# EAGLE schematic SCHEMA0529 (EAGLE 9.6.2)
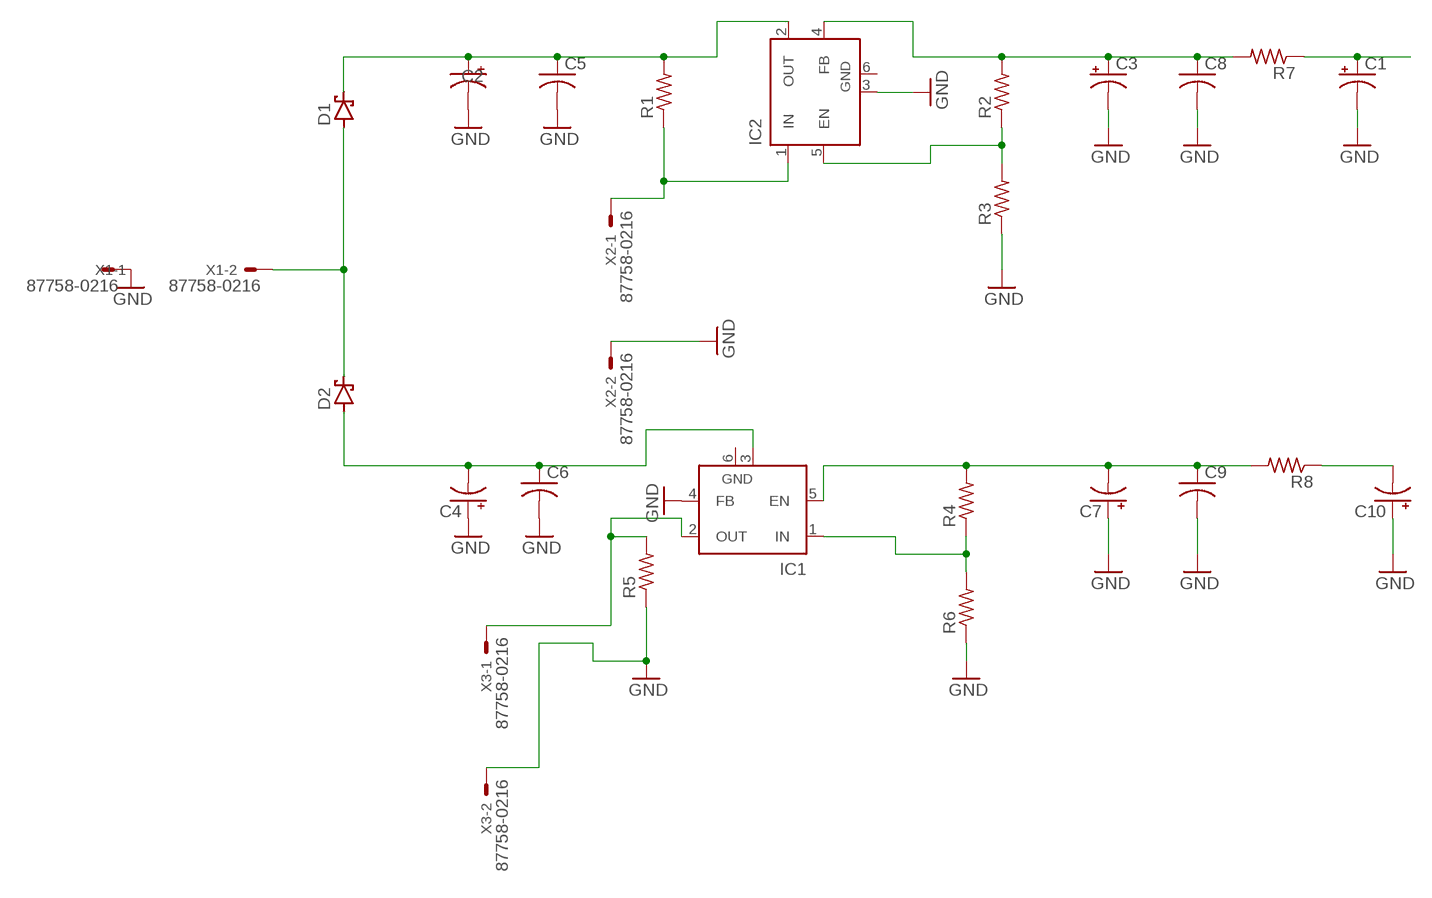
[diagram p0: schematic, sheet 1]

## Parts
C1  CPOL-USTT5D10  [TT5D10]
C2  CPOL-USE7.5-18  [E7,5-18]
C3  CPOL-USD/7343-31R  [D/7343-31R]
C4  CPOL-USE7.5-18  [E7,5-18]
C5  C-USC0805  [C0805]
C6  C-USC0805  [C0805]
C7  CPOL-USD/7343-31R  [D/7343-31R]
C8  C-USC0805  [C0805]
C9  C-USC0805  [C0805]
C10  CPOL-USTT5D10  [TT5D10]
D1  SCHOTTKY-DIODESMD  [SMB]
D2  SCHOTTKY-DIODESMD  [SMB]
IC1  LM2596S  [TO263-5]
IC2  LM2596S  [TO263-5]
R1  R-US_R0805  [R0805]
R2  R-US_R0805  [R0805]
R3  R-US_R0805  [R0805]
R4  R-US_R0805  [R0805]
R5  R-US_R0805  [R0805]
R6  R-US_R0805  [R0805]
R7  R-US_R0805  [R0805]
R8  R-US_R0805  [R0805]
X1  87758-0216  [87758-0216]
X2  87758-0216  [87758-0216]
X3  87758-0216  [87758-0216]

## Nets
GND [New Class]: C1.- C2.- C3.- C4.+ C5.2 C6.2 C7.+ C8.2 C9.2 C10.+ IC1.4(FB) IC2.3(GND) R3.1 R5.1 R6.1 X1.1 X2.2 X3.2
N$1 [New Class]: D1.A D2.C X1.2
N$2 [New Class]: C2.+ C5.1 D1.C IC2.2(OUT) R1.2
N$3 [New Class]: C4.- C6.1 D2.A IC1.3(GND)
N$4 [New Class]: IC2.1(IN) R1.1 X2.1
N$6 [New Class]: C3.+ C8.1 IC2.4(FB) R2.2 R7.2
N$7 [New Class]: IC2.5(EN) R2.1 R3.2
N$8 [New Class]: C7.- C9.1 IC1.5(EN) R4.2 R8.2
N$10 [New Class]: IC1.1(IN) R4.1 R6.2
N$11 [New Class]: IC1.2(OUT) R5.2 X3.1
N$16 [New Class]: C1.+ R7.1
N$17 [New Class]: C10.- R8.1

## Power pins joined to a net without a drawn wire
GND: IC1.6(GND) IC2.6(GND)

## Library data of the parts
C1-C4 C7 C10 = rcl:CPOL-US: POLARIZED CAPACITOR, American symbol; SPICEPREFIX: C
C5 C6 C8 C9 = rcl:C-US: CAPACITOR, American symbol; SPICEPREFIX: C
D1 D2 = diode:SCHOTTKY-DIODE: Schottky Diode
IC1 IC2 = linear:LM2596S: STEP-DOWN VOLTAGE REGULATOR
R1-R8 = rcl:R-US_: RESISTOR, American symbol; SPICEPREFIX: R
X1-X3 = con-molex:87758-0216: 2 Pin - 2mm Dual Row Single Wafer, Vertical T/H HDR Source: http://www.molex.com/pdm_docs/sd/877580616_sd.pdf; MF: MOLEX; MPN: 87758-0216; OC_FARNELL: unknown; OC_NEWARK: 94M1513

## Net classes
1 New Class: width 0.635 mm